# Altium schematic sheet root.SchDoc
size A; SheetNumber: 1; SheetTotal: 5
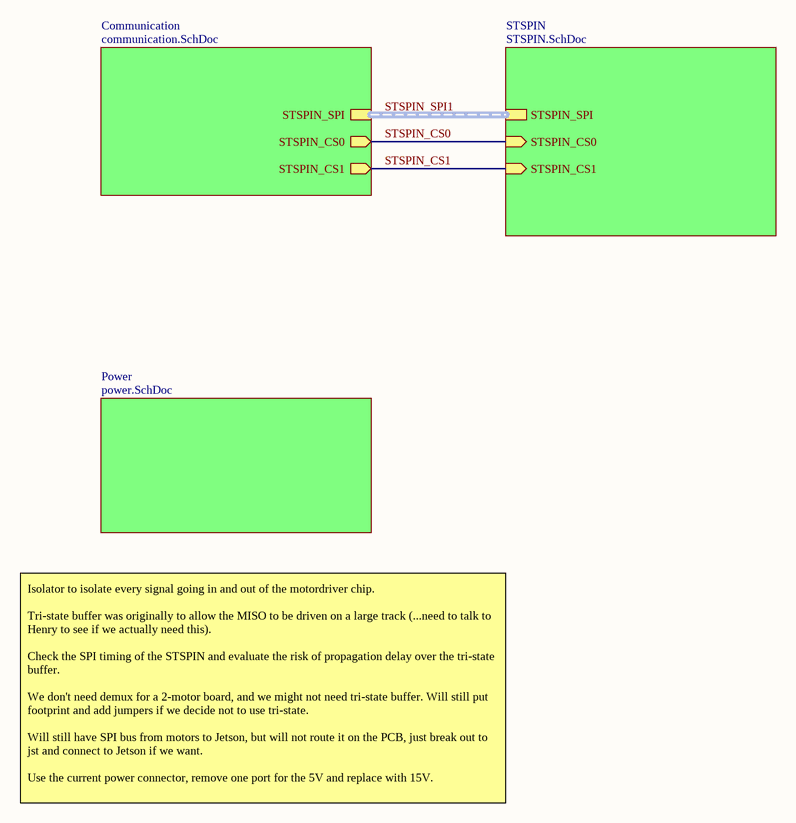
[diagram p0: root.SchDoc]

## Sub-sheets
Communication = communication.SchDoc: STSPIN_CS1 (out), STSPIN_CS0 (out), STSPIN_SPI (harness STSPIN_SPI)
Power = power.SchDoc: no entries
STSPIN = STSPIN.SchDoc: STSPIN_CS0 (in), STSPIN_SPI (harness STSPIN_SPI), STSPIN_CS1 (in)

## Nets
STSPIN_CS0: sheet Communication/STSPIN_CS0, sheet STSPIN/STSPIN_CS0
STSPIN_CS1: sheet Communication/STSPIN_CS1, sheet STSPIN/STSPIN_CS1

## Buses and harness runs
harness STSPIN_SPI1 = sheet Communication/STSPIN_SPI = sheet STSPIN/STSPIN_SPI

## Notes on the sheet
- Isolator to isolate every signal going in and out of the motordriver chip.
  Tri-state buffer was originally to allow the MISO to be driven on a large track (...need to talk to Henry to see if we actually need this).
  Check the SPI timing of the STSPIN and evaluate the risk of propagation delay over the tri-state buffer.
  We don't need demux for a 2-motor board, and we might not need tri-state buffer. Will still put footprint and add jumpers if we decide not to use tri-state.
  Will still have SPI bus from motors to Jetson, but will not route it on the PCB, just break out to jst and connect to Jetson if we want.
  Use the current power connector, remove one port for the 5V and replace with 15V.